# Altium schematic sheet connectors.SchDoc: Connectors
size A4; Revision: 1.0.0; SheetNumber: 10; SheetTotal: 10
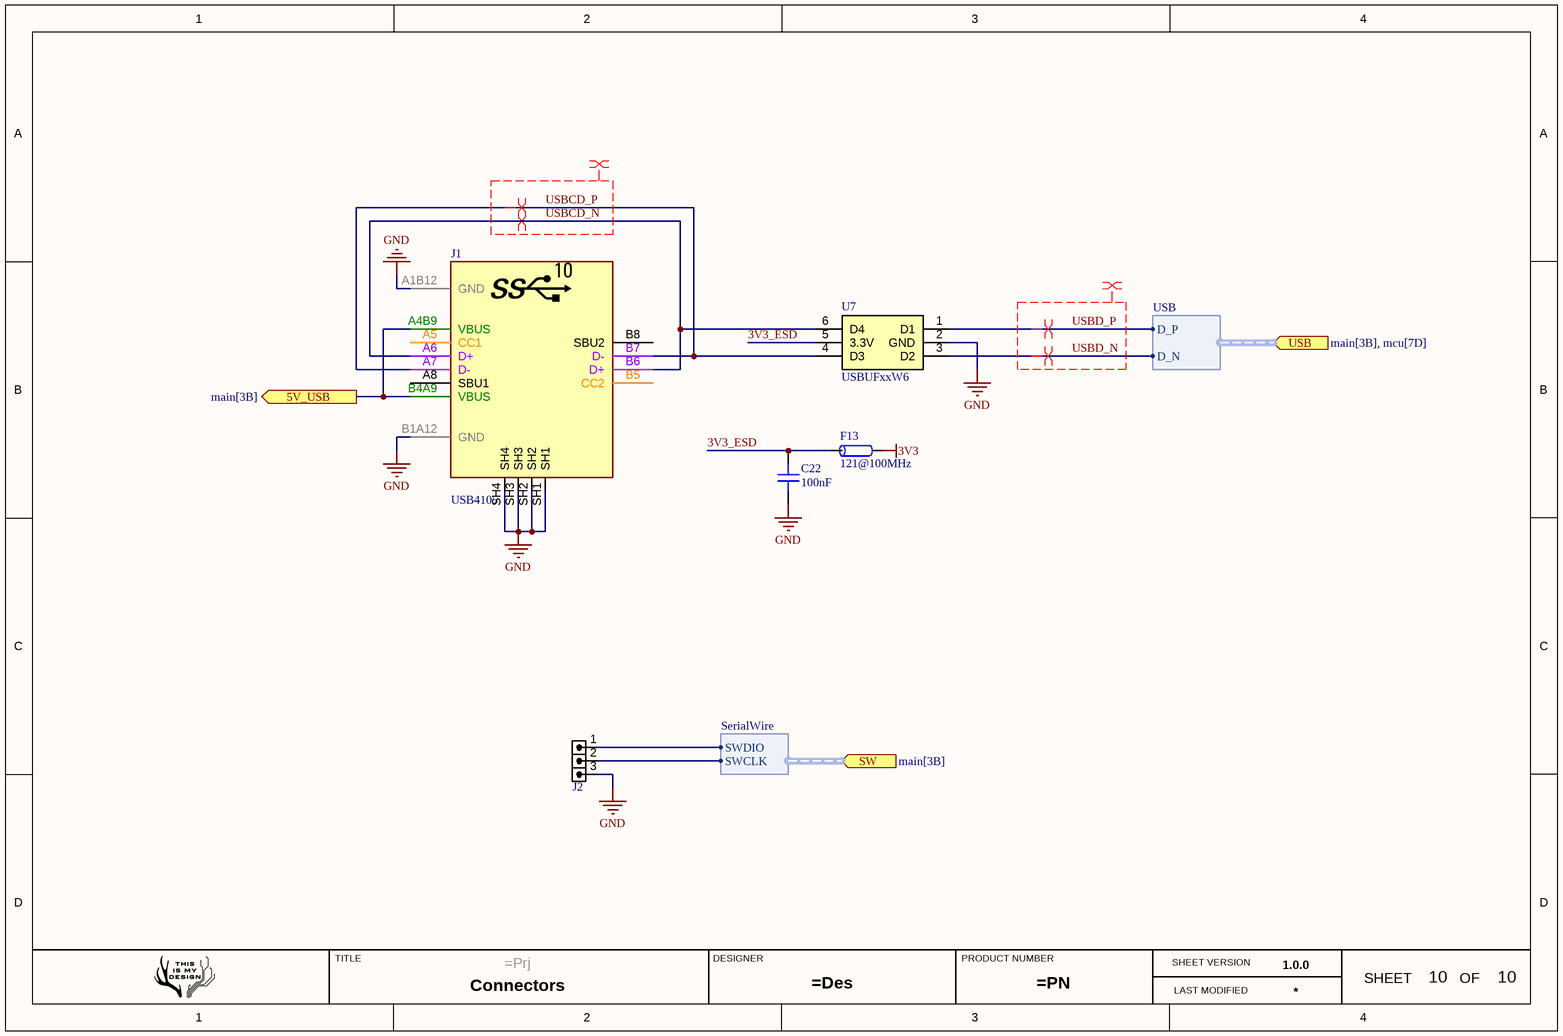
[diagram p0: connectors.SchDoc]

## Parts
C22  100nF  [CAP 0603_1608]
F13  121@100MHz  [Ferrite-0805]
J1  USB4105  [USBC_SMD_16_USB4105]
J2  HDRM3  [HDRR_M_1X3]  (value not drawn)
U7  USBUFxxW6  [SOT23-6L]

## Ports
5V_USB (out, see main[3B]), SW (in, harness SerialWire, see main[3B]), USB (in, harness USB, see main[3B], mcu[7D])

## Harnesses
USB: D_N, D_P
SerialWire: SWDIO, SWCLK

## Nets
3V3: F13.1
GND: C22.1 J1.A1B12(GND) J1.B1A12(GND) J1.SH1 J1.SH2 J1.SH3 J1.SH4 J2.3 U7.2(GND)
3V3_ESD: C22.2 F13.2 U7.5(3.3V)
5V_USB: J1.A4B9(VBUS) J1.B4A9(VBUS) ; port 5V_USB
USBCD_N: J1.A6(D+) J1.B6(D+) U7.6(D4)
USBCD_P: J1.A7(D-) J1.B7(D-) U7.4(D3)
USBD_N: U7.3(D2) ; port USB.D_N
USBD_P: U7.1(D1) ; port USB.D_P
NetJ2_1: J2.1 ; port SW.SWDIO
NetJ2_2: J2.2 ; port SW.SWCLK

Not connected (* = marked no-connect by the designer): J1 A5(CC1) A8(SBU1) B5(CC2) B8(SBU2)

## Layout directives
differential pair: USBCD_N, USBCD_P, USBD_N, USBD_P
net class DIFF90: USBCD_N, USBCD_P, USBD_N, USBD_P

## Notes on the sheet
- TITLE
- DESIGNER
- PRODUCT NUMBER
- SHEET VERSION
- LAST MODIFIED
- SHEET
- OF

## Library data of the parts
C22 = Cap 0603: SMT Capacitor; VALUE: 100nF
F13 = Ferrite Bead
J1 = CONN_USBC_SMD_16_USB4105: CONN, USB, Type C, USB 2.0, Right-Angle, SMD; MANF: GCT; MANF_P#: USB4105-GF-A; PARAM: 5A; Price: 1.5$; Value: USB4105
J2 = HDRR_M_1X3: CONN, HEADER, RightAngle, Male, pitch: 2.54mm, 3POS; VALUE: HDRM3
U7 = USBUFxxW6: USBUF02W6